# EAGLE schematic VCAExpo (EAGLE 7.5.0)
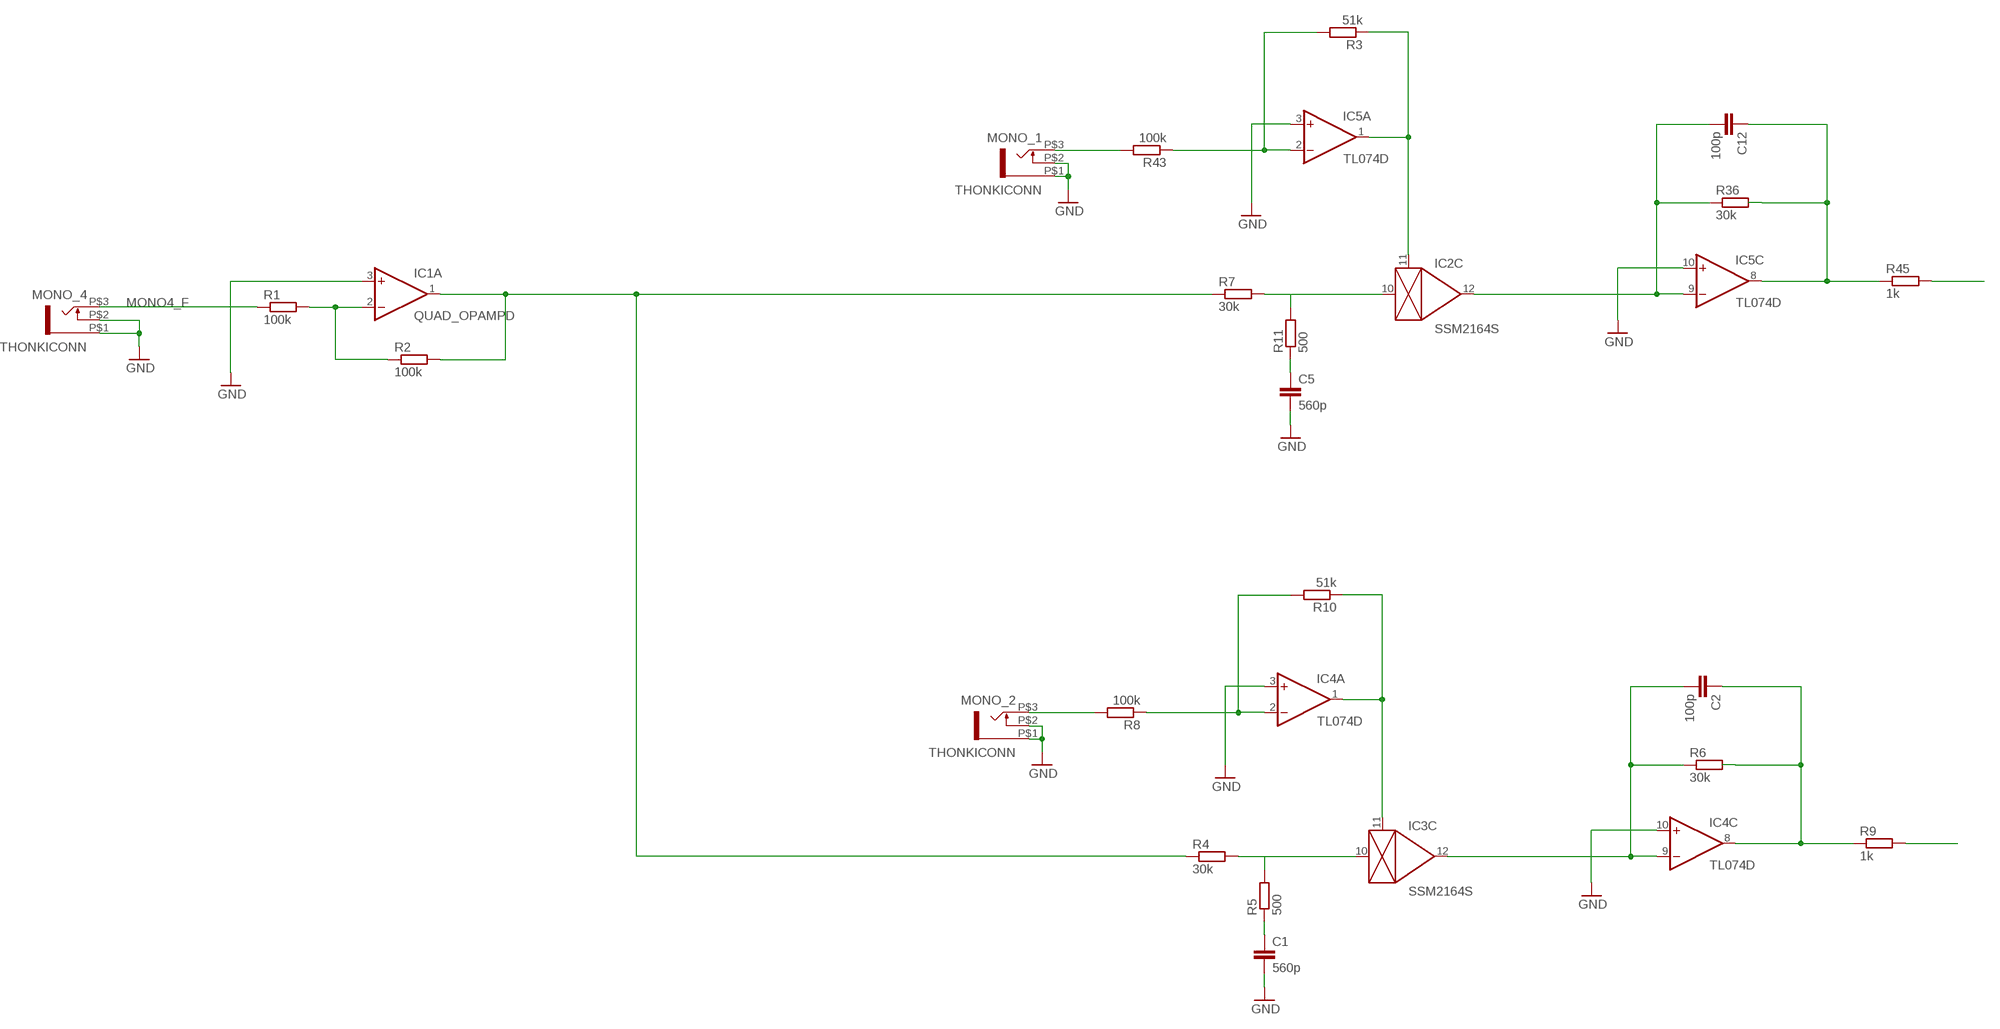
[diagram p0: schematic, sheet 1]

## Parts
C1  560p  C-EUC0603K  [C0603K]
C2  100p  C-EUC0603K  [C0603K]
C5  560p  C-EUC0603K  [C0603K]
C12  100p  C-EUC0603K  [C0603K]
IC1  QUAD_OPAMPD  [SO14]
IC2  SSM2164S  [SOIC16N]
IC3  SSM2164S  [SOIC16N]
IC4  TL074D  [SO14]
IC5  TL074D  [SO14]
MONO_1  THONKICONN  [THONKICONN]
MONO_2  THONKICONN  [THONKICONN]
MONO_4  THONKICONN  [THONKICONN]
R1  100k  R-EU_0603  [0603]
R2  100k  R-EU_0603  [0603]
R3  51k  R-EU_0603  [0603]
R4  30k  R-EU_0603  [0603]
R5  500  R-EU_0603  [0603]
R6  30k  R-EU_0603  [0603]
R7  30k  R-EU_0603  [0603]
R8  100k  R-EU_0603  [0603]
R9  1k  R-EU_0603  [0603]
R10  51k  R-EU_0603  [0603]
R11  500  R-EU_0603  [0603]
R36  30k  R-EU_0603  [0603]
R43  100k  R-EU_0603  [0603]
R45  1k  R-EU_0603  [0603]

## Nets
CV_IN: MONO_1.P$3 R43.2
CV_IN1: MONO_2.P$3 R8.2
GND: C1.2 C5.2 IC1.3(A:+IN) IC4.3(A:+IN) IC4.10(C:+IN) IC5.3(A:+IN) IC5.10(C:+IN) MONO_1.P$1 MONO_1.P$2 MONO_2.P$1 MONO_2.P$2
GND_A: MONO_4.P$1 MONO_4.P$2 ; supply symbol labelled GND
IC2_1: IC3.11(C:CTRL) IC4.1(A:OUT) R10.1
IC2_2: IC4.2(A:-IN) R8.1 R10.2
IC2_4: IC5.2(A:-IN) R3.2 R43.1
IC2_11: IC2.11(C:CTRL) IC5.1(A:OUT) R3.1
MONO4_F: MONO_4.P$3 R1.1
N$1: R45.2
N$2: C1.1 R5.1
N$3: IC1.2(A:-IN) R1.2 R2.1
N$4: IC3.10(C:IN) R4.2 R5.2
N$5: IC1.1(A:OUT) R2.2 R4.1 R7.1
N$6: C2.2 IC3.12(C:OUT) IC4.9(C:-IN) R6.1
N$7: C2.1 IC4.8(C:OUT) R6.2 R9.1
N$8: R9.2
N$19: C5.1 R11.1
N$23: IC2.10(C:IN) R7.2 R11.2
N$49: C12.2 IC2.12(C:OUT) IC5.9(C:-IN) R36.1
N$51: C12.1 IC5.8(C:OUT) R36.2 R45.1
Unconnected: IC1.5(B:+IN) IC1.6(B:-IN) IC1.7(B:OUT) IC1.8(C:OUT) IC1.9(C:-IN) IC1.10(C:+IN) IC1.12(D:+IN) IC1.13(D:-IN) IC1.14(D:OUT) IC2.1(E:MODE) IC2.2(A:IN) IC2.3(A:CTRL) IC2.4(A:OUT) IC2.5(B:OUT) IC2.6(B:CTRL) IC2.7(B:IN) IC2.13(D:OUT) IC2.14(D:CTRL) IC2.15(D:IN) IC3.1(E:MODE) IC3.2(A:IN) IC3.3(A:CTRL) IC3.4(A:OUT) IC3.5(B:OUT) IC3.6(B:CTRL) IC3.7(B:IN) IC3.13(D:OUT) IC3.14(D:CTRL) IC3.15(D:IN) IC4.5(B:+IN) IC4.6(B:-IN) IC4.7(B:OUT) IC4.12(D:+IN) IC4.13(D:-IN) IC4.14(D:OUT) IC5.5(B:+IN) IC5.6(B:-IN) IC5.7(B:OUT) IC5.12(D:+IN) IC5.13(D:-IN) IC5.14(D:OUT)

## Power pins joined to a net without a drawn wire
GND: IC2.8(E:GND) IC3.8(E:GND)
V+: IC1.4(P:V+) IC2.16(E:V+) IC3.16(E:V+) IC4.4(P:V+) IC5.4(P:V+)
V-: IC1.11(P:V-) IC2.9(E:V-) IC3.9(E:V-) IC4.11(P:V-) IC5.11(P:V-)

## Library data of the parts
C1 C2 C5 C12 = resistor:C-EU: CAPACITOR, European symbol
IC1 = adafruit:QUAD_OPAMP: OP AMP Standard quad package
IC2 IC3 = ssm2164:SSM2164
IC4 IC5 = linear:TL074: OP AMP
MONO_1 MONO_2 MONO_4 = Rebel:THONKICONN
R1-R11 R36 R43 R45 = Rebel:R-EU_: RESISTOR, European symbol